# Altium schematic sheet MCU.SchDoc
size A4
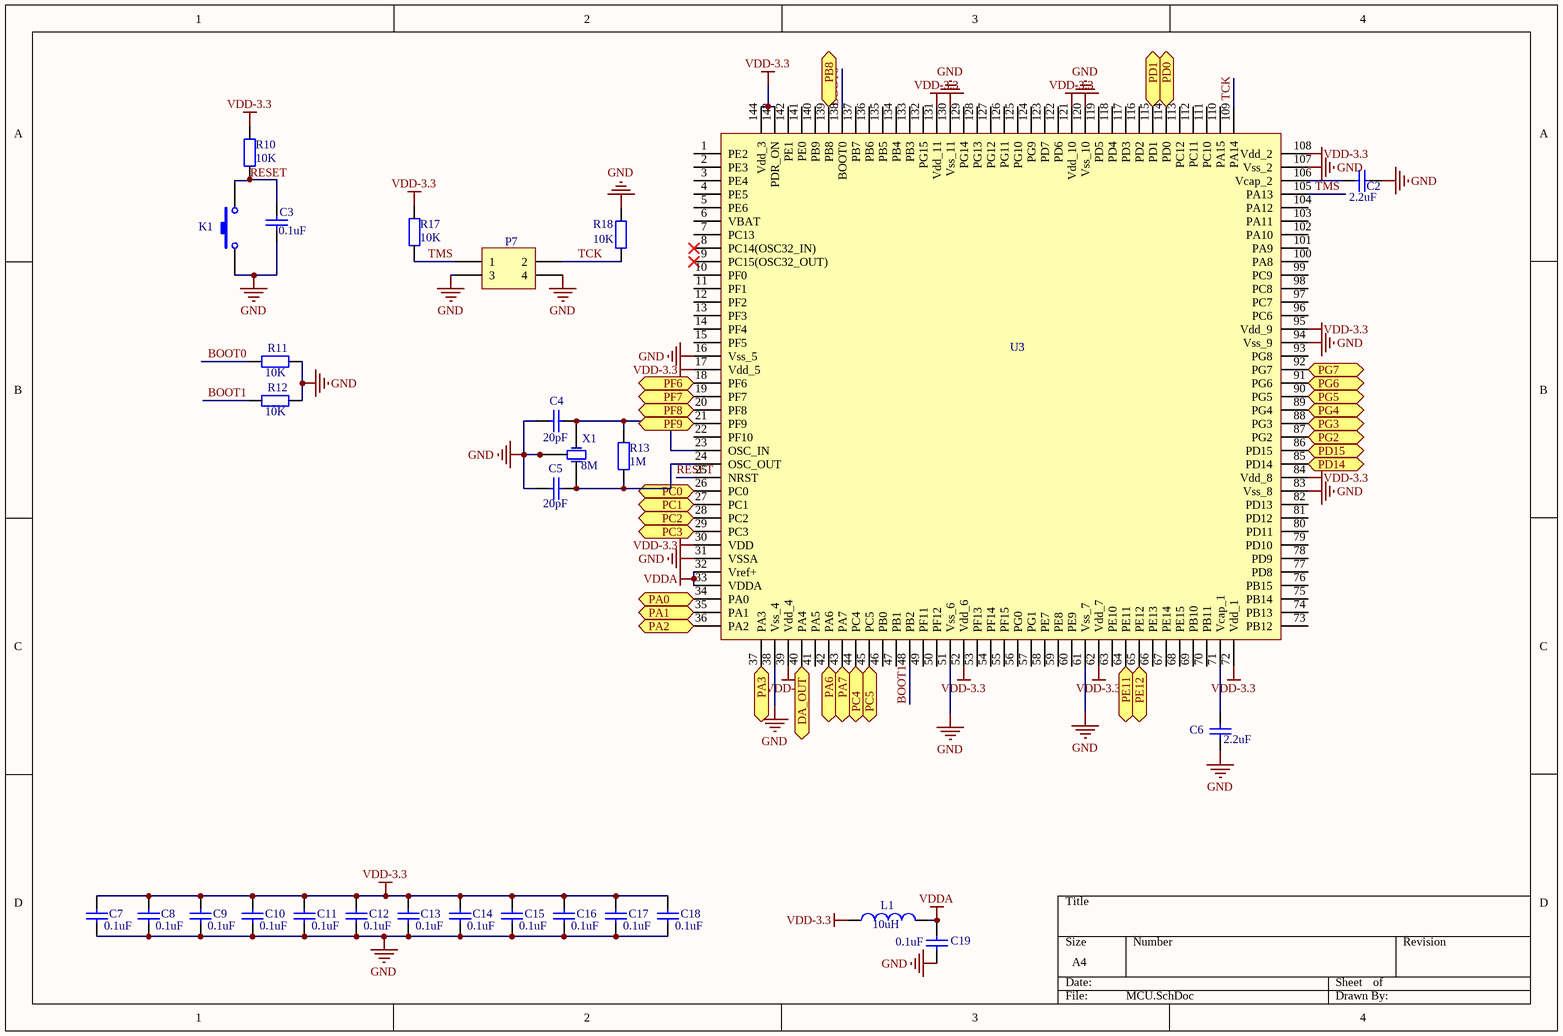
[diagram p0: MCU.SchDoc]

## Parts
C2  value 2.2uF  [0603]  (hidden comment: Capacitor-0603)
C3  value 0.1uF  [0603]  (hidden comment: Capacitor-0805)
C4  value 20pF  [0603]  (hidden comment: Capacitor-0603)
C5  value 20pF  [0603]  (hidden comment: Capacitor-0603)
C6  value 2.2uF  [0603]  (hidden comment: Capacitor-0603)
C7  value 0.1uF  [0603]  (hidden comment: Capacitor-0603)
C8  value 0.1uF  [0603]  (hidden comment: Capacitor-0603)
C9  value 0.1uF  [0603]  (hidden comment: Capacitor-0603)
C10  value 0.1uF  [0603]  (hidden comment: Capacitor-0603)
C11  value 0.1uF  [0603]  (hidden comment: Capacitor-0603)
C12  value 0.1uF  [0603]  (hidden comment: Capacitor-0603)
C13  value 0.1uF  [0603]  (hidden comment: Capacitor-0603)
C14  value 0.1uF  [0603]  (hidden comment: Capacitor-0603)
C15  value 0.1uF  [0603]  (hidden comment: Capacitor-0603)
C16  value 0.1uF  [0603]  (hidden comment: Capacitor-0603)
C17  value 0.1uF  [0603]  (hidden comment: Capacitor-0603)
C18  value 0.1uF  [0603]  (hidden comment: Capacitor-0603)
C19  value 0.1uF  [0603]  (hidden comment: Capacitor-0805)
K1  按键  [贴片按键]  (value not drawn)
L1  value 10uH  [0805]  (hidden comment: Inductor)
P7  Header 2X2  [HDR2X2]  (value not drawn)
R10  value 10K  [0603]  (hidden comment: Resistor-0805)
R11  value 10K  [0603]  (hidden comment: Resistor-0805)
R12  value 10K  [0603]  (hidden comment: Resistor-0805)
R13  value 1M  [0603]  (hidden comment: Resistor-0603)
R17  value 10K  [0603]  (hidden comment: Resistor-0805)
R18  value 10K  [0603]  (hidden comment: Resistor-0805)
U3  value STM32F407ZET6  [Stm32f407ZET6 - duplicate]  (hidden comment: STM32F407ZGT6)
X1  value 8M  [3225无源晶振]  (hidden comment: 3225无源晶振)

## Ports
DA_OUT (out), PA0 (out), PA1 (out), PA2 (out), PA3 (out), PA6 (out), PA7 (out), PB8 (out), PC0 (out), PC1 (out), PC2 (out), PC3 (out), PC4 (out), PC5 (out), PD0 (in), PD1 (in), PD14, PD15, PE11, PE12, PF6 (out), PF7 (out), PF8 (out), PF9 (out), PG2, PG3, PG4, PG5, PG6, PG7

## Nets
GND: C2.2 C3.1 C4.1 C5.1 C6.1 C7.1 C8.1 C9.1 C10.1 C11.1 C12.1 C13.1 C14.1 C15.1 C16.1 C17.1 C18.1 C19.1 K1.1 P7.3 P7.4 R11.1 R12.1 R18.2 U3.16(Vss_5) U3.31(VSSA) U3.38(Vss_4) U3.51(Vss_6) U3.61(Vss_7) U3.83(Vss_8) U3.94(Vss_9) U3.107(Vss_2) U3.120(Vss_10) U3.130(Vss_11) X1.2(GND) X1.4(GND)
VDD-3.3: C7.2 C8.2 C9.2 C10.2 C11.2 C12.2 C13.2 C14.2 C15.2 C16.2 C17.2 C18.2 L1.1 R10.2 R17.1 U3.17(Vdd_5) U3.30(VDD) U3.39(Vdd_4) U3.52(Vdd_6) U3.62(Vdd_7) U3.72(Vdd_1) U3.84(Vdd_8) U3.95(Vdd_9) U3.108(Vdd_2) U3.121(Vdd_10) U3.131(Vdd_11) U3.143(PDR_ON) U3.144(Vdd_3)
VDDA: C19.2 L1.2 U3.32(Vref+) U3.33(VDDA)
BOOT0: R11.2 U3.138(BOOT0)
BOOT1: R12.2 U3.48(PB2)
DA_OUT: U3.40(PA4) ; port DA_OUT
PA0: U3.34(PA0) ; port PA0
PA1: U3.35(PA1) ; port PA1
PA2: U3.36(PA2) ; port PA2
PA3: U3.37(PA3) ; port PA3
PA6: U3.42(PA6) ; port PA6
PA7: U3.43(PA7) ; port PA7
PB8: U3.139(PB8) ; port PB8
PC0: U3.26(PC0) ; port PC0
PC1: U3.27(PC1) ; port PC1
PC2: U3.28(PC2) ; port PC2
PC3: U3.29(PC3) ; port PC3
PC4: U3.44(PC4) ; port PC4
PC5: U3.45(PC5) ; port PC5
PD0: U3.114(PD0) ; port PD0
PD1: U3.115(PD1) ; port PD1
PD14: U3.85(PD14) ; port PD14
PD15: U3.86(PD15) ; port PD15
PE11: U3.64(PE11) ; port PE11
PE12: U3.65(PE12) ; port PE12
PF6: U3.18(PF6) ; port PF6
PF7: U3.19(PF7) ; port PF7
PF8: U3.20(PF8) ; port PF8
PF9: U3.21(PF9) ; port PF9
PG2: U3.87(PG2) ; port PG2
PG3: U3.88(PG3) ; port PG3
PG4: U3.89(PG4) ; port PG4
PG5: U3.90(PG5) ; port PG5
PG6: U3.91(PG6) ; port PG6
PG7: U3.92(PG7) ; port PG7
RESET: C3.2 K1.2 R10.1 U3.25(NRST)
TCK: P7.2 R18.1 U3.109(PA14)
TMS: P7.1 R17.2 U3.105(PA13)
NetC2_1: C2.1 U3.106(Vcap_2)
NetC4_2: C4.2 R13.2 U3.23(OSC_IN) X1.1(OSC1)
NetC5_2: C5.2 R13.1 U3.24(OSC_OUT) X1.3(OSC2)
NetC6_2: C6.2 U3.71(Vcap_1)

Not connected (* = marked no-connect by the designer): U3 1(PE2) 2(PE3) 3(PE4) 4(PE5) 5(PE6) 6(VBAT) 7(PC13) 8(PC14(OSC32_IN))* 9(PC15(OSC32_OUT))* 10(PF0) 11(PF1) 12(PF2) 13(PF3) 14(PF4) 15(PF5) 22(PF10) 41(PA5) 46(PB0) 47(PB1) 49(PF11) 50(PF12) 53(PF13) 54(PF14) 55(PF15) 56(PG0) 57(PG1) 58(PE7) 59(PE8) 60(PE9) 63(PE10) 66(PE13) 67(PE14) 68(PE15) 69(PB10) 70(PB11) 73(PB12) 74(PB13) 75(PB14) 76(PB15) 77(PD8) 78(PD9) 79(PD10) 80(PD11) 81(PD12) 82(PD13) 93(PG8) 96(PC6) 97(PC7) 98(PC8) 99(PC9) 100(PA8) 101(PA9) 102(PA10) 103(PA11) 104(PA12) 110(PA15) 111(PC10) 112(PC11) 113(PC12) 116(PD2) 117(PD3) 118(PD4) 119(PD5) 122(PD6) 123(PD7) 124(PG9) 125(PG10) 126(PG11) 127(PG12) 128(PG13) 129(PG14) 132(PG15) 133(PB3) 134(PB4) 135(PB5) 136(PB6) 137(PB7) 140(PB9) 141(PE0) 142(PE1)

## Library data of the parts
C3 = Capacitor-0
C19 = Capacitor
L1 = Ind
P7 = Header 2X2: Header, 2-Pin, Dual row; LatestRevisionDate: 17-Jul-2002; LatestRevisionNote: Re-released for DXP Platform.; Publisher: Altium Limited
R10-R12 R17 R18 = Resistor-0
U3 = STM32F407ZET6